# EAGLE design takujou_memo (EAGLE 9.6.2)
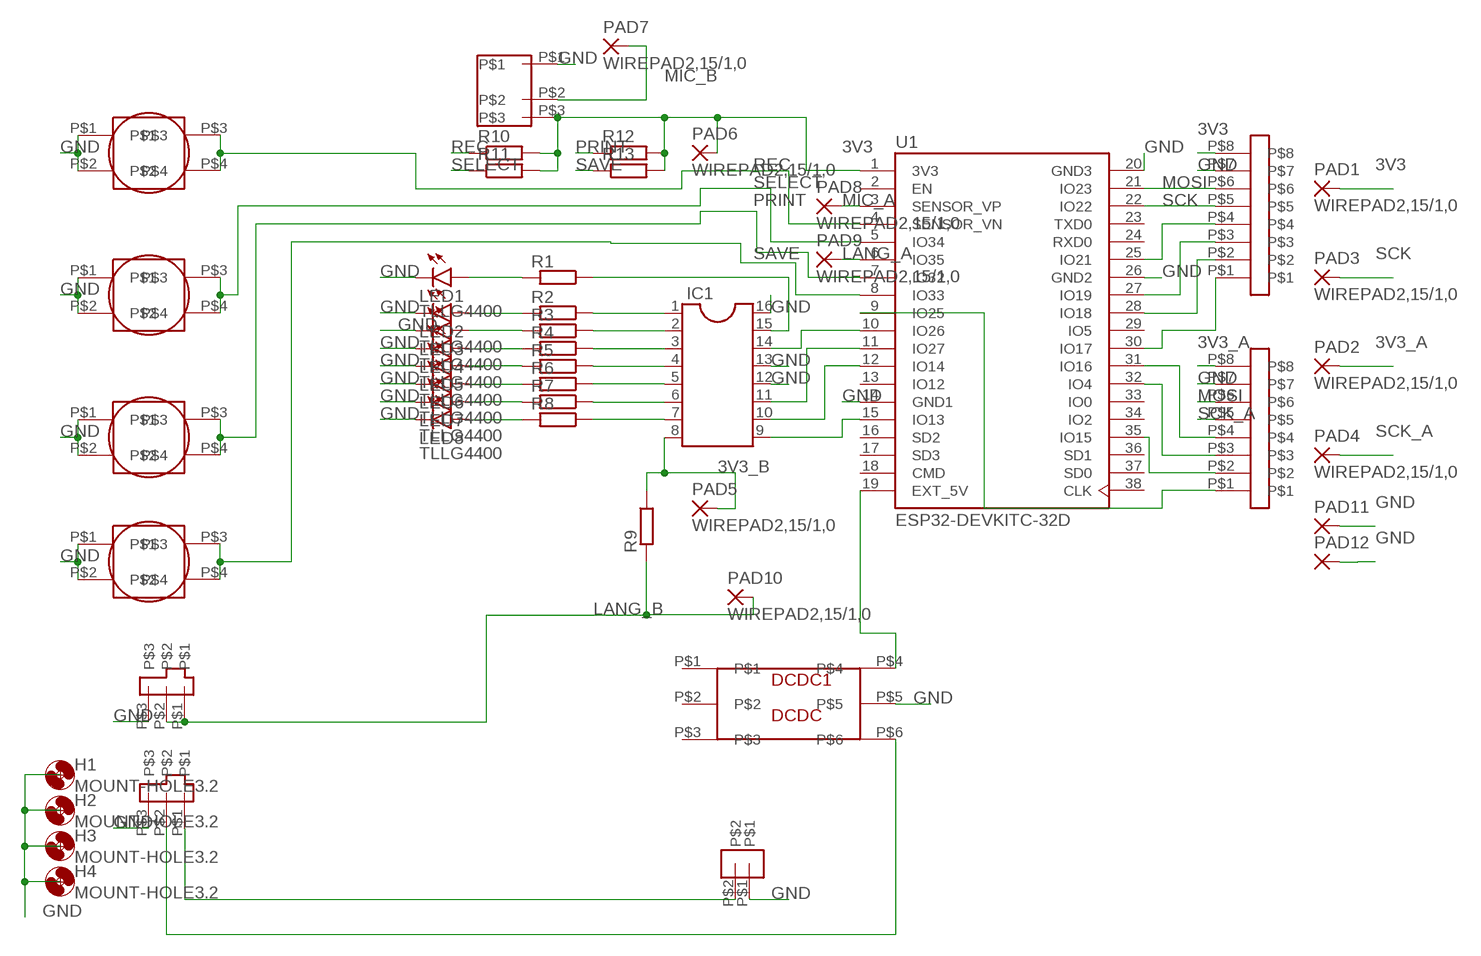
[diagram p0: schematic, sheet 1]

## Parts
BATTERY1  BATTERY  [BATTERY]
DCDC1  DCDC  [DCDC]
DISPLAY1  DISPLAY  [DISPLAY]
DISPLAY2  DISPLAY  [DISPLAY]
H1  MOUNT-HOLE3.2  [3,2]
H2  MOUNT-HOLE3.2  [3,2]
H3  MOUNT-HOLE3.2  [3,2]
H4  MOUNT-HOLE3.2  [3,2]
IC1  DIL16S  [SOCKET-16]
LED1  TLLG4400  [LED3MM]
LED2  TLLG4400  [LED3MM]
LED3  TLLG4400  [LED3MM]
LED4  TLLG4400  [LED3MM]
LED5  TLLG4400  [LED3MM]
LED6  TLLG4400  [LED3MM]
LED7  TLLG4400  [LED3MM]
LED8  TLLG4400  [LED3MM]
MIC1  MIC  [MIC]
PAD1  WIREPAD2,15/1,0  [2,15/1,0]
PAD2  WIREPAD2,15/1,0  [2,15/1,0]
PAD3  WIREPAD2,15/1,0  [2,15/1,0]
PAD4  WIREPAD2,15/1,0  [2,15/1,0]
PAD5  WIREPAD2,15/1,0  [2,15/1,0]
PAD6  WIREPAD2,15/1,0  [2,15/1,0]
PAD7  WIREPAD2,15/1,0  [2,15/1,0]
PAD8  WIREPAD2,15/1,0  [2,15/1,0]
PAD9  WIREPAD2,15/1,0  [2,15/1,0]
PAD10  WIREPAD2,15/1,0  [2,15/1,0]
PAD11  2,15/1,0  [2,15/1,0]
PAD12  2,15/1,0  [2,15/1,0]
R1  SMK  [SMK]
R2  SMK  [SMK]
R3  SMK  [SMK]
R4  SMK  [SMK]
R5  SMK  [SMK]
R6  SMK  [SMK]
R7  SMK  [SMK]
R8  SMK  [SMK]
R9  SMK  [SMK]
R10  R-EU_0207/10  [0207/10]
R11  R-EU_0207/10  [0207/10]
R12  R-EU_0207/10  [0207/10]
R13  R-EU_0207/10  [0207/10]
SWITCH1  SWITCH  [SWITCH]
SWITCH2  SWITCH  [SWITCH]
SWITCH3  SWITCH  [SWITCH]
SWITCH4  SWITCH  [SWITCH]
TOGGLE1  TOGGLE  [TOGGLE]
TOGGLE2  TOGGLE  [TOGGLE]
U1  ESP32-DEVKITC-32D  [MODULE_ESP32-DEVKITC-32D]

## Nets
3V3: DISPLAY1.P$8 MIC1.P$3 PAD1.1(P) PAD6.1(P) R10.2 R11.2 R12.2 R13.2 U1.1(3V3)
3V3_A: DISPLAY2.P$8 PAD2.1(P)
3V3_B: IC1.8 PAD5.1(P) R9.1
GND: BATTERY1.P$1 DCDC1.P$5 DISPLAY1.P$7 DISPLAY2.P$7 IC1.12 IC1.13 IC1.16 LED1.K(C) LED2.K(C) LED3.K(C) LED4.K(C) LED5.K(C) LED6.K(C) LED7.K(C) LED8.K(C) MIC1.P$1 PAD11.1(P) PAD12.1(P) SWITCH1.P$1 SWITCH1.P$2 SWITCH2.P$1 SWITCH2.P$2 SWITCH3.P$1 SWITCH3.P$2 SWITCH4.P$1 SWITCH4.P$2 TOGGLE1.P$3 TOGGLE2.P$3 U1.14(GND1) U1.20(GND3) U1.26(GND2)
LANG_A: PAD9.1(P) U1.6(IO35)
LANG_B: PAD10.1(P) R9.2 TOGGLE1.P$1 TOGGLE1.P$2
MIC_A: PAD8.1(P) U1.3(SENSOR_VP)
MIC_B: MIC1.P$2 PAD7.1(P)
MOSI: DISPLAY1.P$6 DISPLAY2.P$6 U1.21(IO23)
N$1: DISPLAY1.P$4 U1.25(IO21)
N$2: DISPLAY1.P$3 U1.27(IO19)
N$3: DISPLAY1.P$2 U1.28(IO18)
N$4: DISPLAY1.P$1 U1.30(IO17)
N$5: DISPLAY2.P$4 U1.31(IO16)
N$6: DISPLAY2.P$3 U1.32(IO4)
N$7: DISPLAY2.P$2 U1.35(IO15)
N$8: DISPLAY2.P$1 U1.9(IO25)
N$9: IC1.9 U1.15(IO13)
N$10: IC1.10 U1.12(IO14)
N$11: IC1.11 U1.11(IO27)
N$12: IC1.14 U1.10(IO26)
N$13: IC1.15 R1.1
N$14: IC1.1 R2.1
N$15: IC1.2 R3.1
N$16: IC1.3 R4.1
N$17: IC1.4 R5.1
N$18: IC1.5 R6.1
N$19: IC1.6 R7.1
N$20: IC1.7 R8.1
N$21: DCDC1.P$4 U1.19(EXT_5V)
N$22: LED1.A R1.2
N$23: LED2.A R2.2
N$24: LED3.A R3.2
N$25: LED4.A R4.2
N$26: LED5.A R5.2
N$27: LED6.A R6.2
N$28: LED7.A R7.2
N$29: LED8.A R8.2
N$30: DCDC1.P$6 TOGGLE2.P$2
N$31: BATTERY1.P$2 TOGGLE2.P$1
PRINT: R12.1 SWITCH3.P$3 SWITCH3.P$4 U1.7(IO32)
REC: R10.1 SWITCH1.P$3 SWITCH1.P$4 U1.4(SENSOR_VN)
SAVE: R13.1 SWITCH4.P$3 SWITCH4.P$4 U1.8(IO33)
SCK: DISPLAY1.P$5 PAD3.1(P) U1.22(IO22)
SCK_A: DISPLAY2.P$5 PAD4.1(P)
SELECT: R11.1 SWITCH2.P$3 SWITCH2.P$4 U1.5(IO34)
Unconnected: DCDC1.P$1 DCDC1.P$2 DCDC1.P$3 U1.2(EN) U1.13(IO12) U1.16(SD2) U1.17(SD3) U1.18(CMD) U1.23(TXD0) U1.24(RXD0) U1.29(IO5) U1.33(IO0) U1.34(IO2) U1.36(SD1) U1.37(SD0) U1.38(CLK)

## Library data of the parts
BATTERY1 = BATTERY:BATTERY
DCDC1 = DCDC:DCDC
DISPLAY1 DISPLAY2 = DISPLAY:DISPLAY
H1-H4 = holes:MOUNT-HOLE: MOUNTING HOLE with drill center marker
IC1 = ic-package:DIL16: Dual In Line / Socket
LED1-LED8 = led:TLLG4400: Low Current (2mA) LED 3 mm Tinted Diffused Package color GREEN Source: Data sheet <http://www.farnell.com/datasheets/391098.pdf>; MF: VISHAY SEMICONDUCTOR; OC_FARNELL: 1612435
MIC1 = MIC:MIC
PAD1-PAD10 = wirepad:WIREPAD: Wire PAD connect wire on PCB
PAD11 PAD12 = wirepad:2,15/1,0: THROUGH-HOLE PAD
R1-R9 = resistor-shunt:SMK: SMD SHUNT RESISTOR; OC_FARNELL: unknown; OC_NEWARK: unknown
R10-R13 = rcl:R-EU_: RESISTOR, European symbol; SPICEPREFIX: R
SWITCH1-SWITCH4 = SWITCH:SWITCH
TOGGLE1 TOGGLE2 = TOGGLE:TOGGLE
U1 = ESP32-DEVKITC-32D:ESP32-DEVKITC-32D: Eval Board For Esp-Wroom-32 Check availability <https://pricing.snapeda.com/parts/ESP32-DEVKITC-32D/Espressif%20Systems/view-part?ref=eda>; AVAILABILITY: In Stock; DESCRIPTION: WiFi Development Tools (802.11) ESP32 General Development Kit, ESP32-WROOM-32D on the board; MF: Espressif Systems; MP: ESP32-DEVKITC-32D; PACKAGE: None; PRICE: None; PURCHASE-URL: https://pricing.snapeda.com/search/part/ESP32-DEVKITC-32D/?ref=eda

## Board
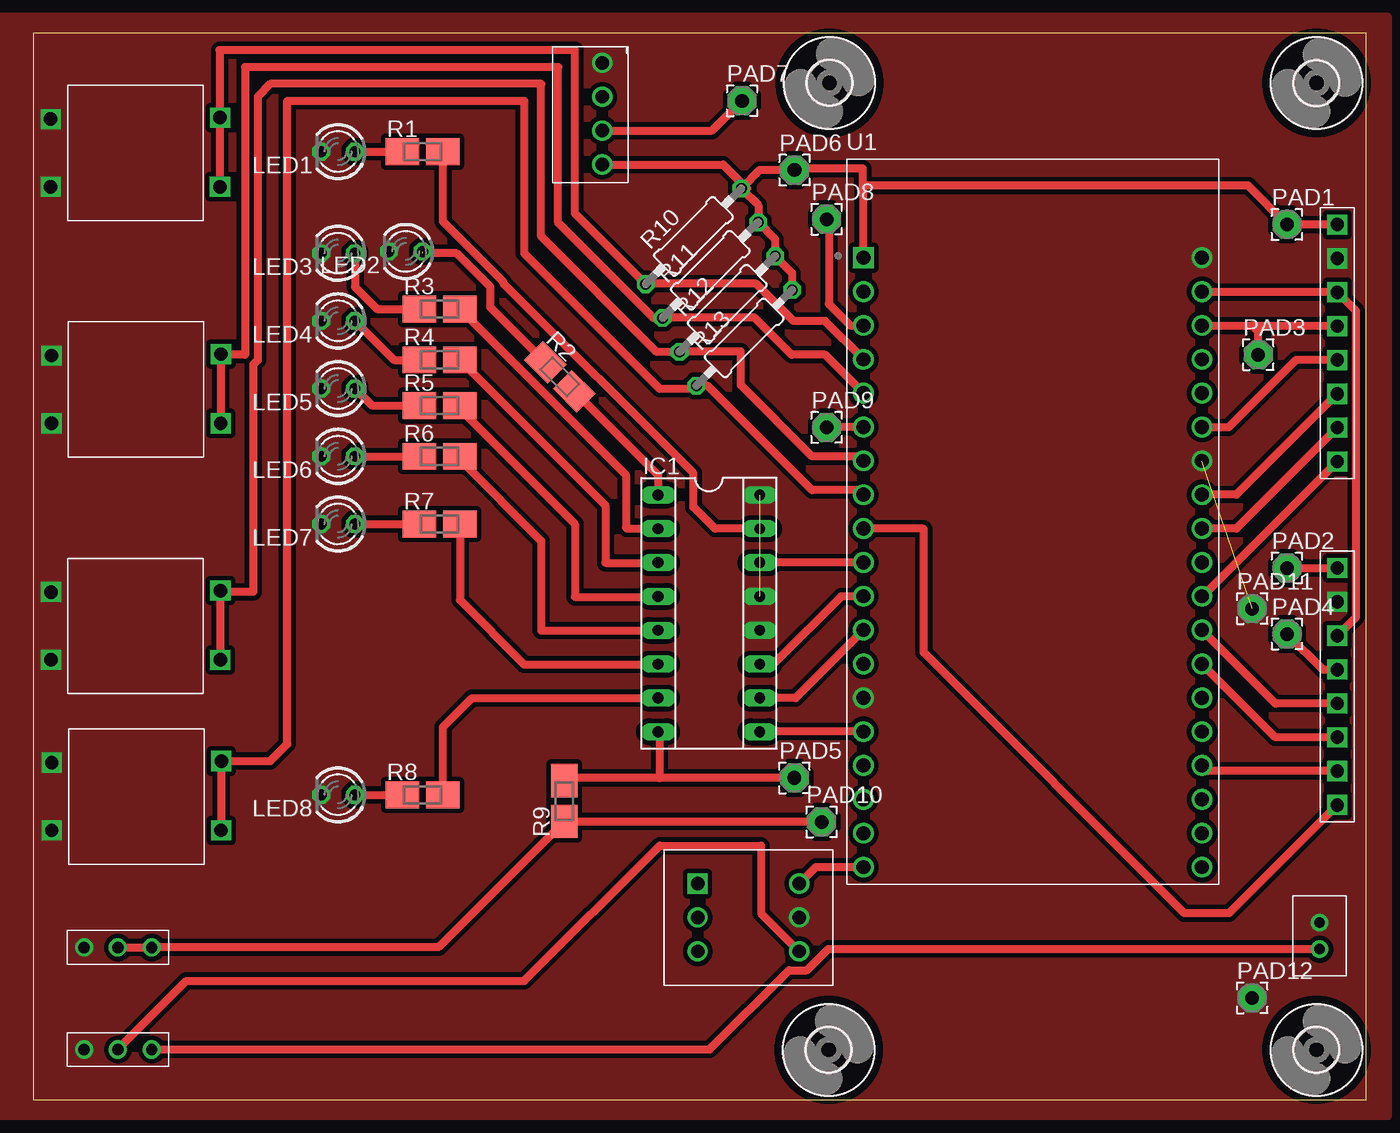
[diagram p1: board, top side]

Size 100 x 80 mm. Coordinates in mm from the lower left corner, seen from the top.
Outline: 0,0 100,0 100,80 0,80 0,0
Copper layers (1*16): Top 0.035mm / dielectric 1.5mm / Bottom 0.035mm
Design rules "default *": minimum track width 6mil, minimum drill 0.6mm, track to track 14mil, track to pad 14mil, pad to pad 14mil, via to via 14mil, smd to smd 6mil, copper to edge 0mil, drill to drill 6mil, minimum pad ring 10mil, minimum via ring 8mil, stop-mask expansion 4mil, vias tented up to drill 0mil, thermal gap 10mil

### Footprints (pad centres in the part's own frame; a part is rotated, then mirrored left to right if it is on the bottom)
BATTERY = drill 0.8: P$1 0,2; P$2 0,0
DCDC = drill 1 square: P$1 -5.08,2.54 | drill 1: P$2 -5.08,0; P$3 -5.08,-2.54; P$4 2.54,2.54; P$5 2.54,0; P$6 2.54,-2.54
DISPLAY = drill 1 square: P$1 0,7.62; P$2 0,5.08; P$3 0,2.54; P$4 0,0; P$5 0,-2.54; P$6 0,-5.08; P$7 0,-7.62; P$8 0,-10.16
3,2 = hole 3.2: 0,0
SOCKET-16 = drill 0.813 long: 1 -8.89,-3.81; 2 -6.35,-3.81; 3 -3.81,-3.81; 4 -1.27,-3.81; 5 1.27,-3.81; 6 3.81,-3.81; 7 6.35,-3.81; 8 8.89,-3.81; 9 8.89,3.81; 10 6.35,3.81; 11 3.81,3.81; 12 1.27,3.81; 13 -1.27,3.81; 14 -3.81,3.81; 15 -6.35,3.81; 16 -8.89,3.81
LED3MM = drill 0.813 octagon: A -1.27,0; K 1.27,0
MIC = drill 1: P$1 2.54,5.08; P$2 2.54,0; P$3 2.54,-2.54; P$4 2.54,2.54
2,15/1,0 = drill 1.016 pad 2.159 octagon: 1 0,0
SMK = smd 2.5 x 2: 1 1.524,0; 2 -1.524,0
0207/10 = drill 0.813 octagon: 1 -5.08,0; 2 5.08,0
SWITCH = drill 1 square: P$1 -6.35,2.54; P$2 -6.35,-2.54; P$3 6.35,-2.54; P$4 6.364,2.652
TOGGLE = drill 0.85: P$1 0,2.54; P$2 0,0; P$3 0,-2.54
MODULE_ESP32-DEVKITC-32D = drill 1.04 square: 1 -12.7,19.76 | drill 1.04: 2 -12.7,17.22; 3 -12.7,14.68; 4 -12.7,12.14; 5 -12.7,9.6; 6 -12.7,7.06; 7 -12.7,4.52; 8 -12.7,1.98; 9 -12.7,-0.56; 10 -12.7,-3.1; 11 -12.7,-5.64; 12 -12.7,-8.18; 13 -12.7,-10.72; 14 -12.7,-13.26; 15 -12.7,-15.8; 16 -12.7,-18.34; 17 -12.7,-20.88; 18 -12.7,-23.42; 19 -12.7,-25.96; 20 12.7,19.76; 21 12.7,17.22; 22 12.7,14.68; 23 12.7,12.14; 24 12.7,9.6; 25 12.7,7.06; 26 12.7,4.52; 27 12.7,1.98; 28 12.7,-0.56; 29 12.7,-3.1; 30 12.7,-5.64; 31 12.7,-8.18; 32 12.7,-10.72; 33 12.7,-13.26; 34 12.7,-15.8; 35 12.7,-18.34; 36 12.7,-20.88; 37 12.7,-23.42; 38 12.7,-25.96

### Placement (x,y rotation side)
BATTERY1  96.51,11.28 0 top
DCDC1  54.92,13.66 0 top
DISPLAY1  97.84,55.49 180 top
DISPLAY2  97.84,29.72 180 top
H1  96.27,76.27 0 top
H2  96.27,3.73 0 top
H3  59.73,76.29 0 top
H4  59.67,3.73 0 top
IC1  50.69,36.48 270 top
LED1  22.86,71.12 180 top
LED2  27.94,63.63 180 top
LED3  22.86,63.5 180 top
LED4  22.86,58.42 180 top
LED5  22.86,53.34 180 top
LED6  22.86,48.26 180 top
LED7  22.86,43.18 180 top
LED8  22.86,22.86 180 top
MIC1  40.15,72.7 0 top
PAD1  94.06,65.66 0 top
PAD2  94.06,39.88 0 top
PAD3  91.9,55.88 0 top
PAD4  94.06,34.92 0 top
PAD5  57.1,24.13 0 top
PAD6  57.11,69.73 0 top
PAD7  53.17,74.94 0 top
PAD8  59.52,66.05 0 top
PAD9  59.52,50.43 0 top
PAD10  59.13,20.83 0 top
PAD11  91.44,36.83 0 top
PAD12  91.44,7.62 0 top
R1  29.21,71.12 0 top
R2  39.5,54.23 315 top
R3  30.48,59.31 0 top
R4  30.48,55.5 0 top
R5  30.48,52.07 0 top
R6  30.48,48.26 0 top
R7  30.48,43.18 0 top
R8  29.21,22.86 0 top
R9  39.84,22.39 90 top
R10  49.53,64.77 45 top
R11  50.8,62.23 45 top
R12  52.07,59.69 45 top
R13  53.34,57.15 45 top
SWITCH1  7.65,71.03 0 top
SWITCH2  7.71,53.28 0 top
SWITCH3  7.68,35.53 0 top
SWITCH4  7.74,22.74 0 top
TOGGLE1  6.34,11.41 270 top
TOGGLE2  6.34,3.75 270 top
U1  74.98,43.4 0 top

### Tracks (layer width: path | path; a pad name or v marks a point on that pad's centre or on a via)
3V3
  Top 0.152: PAD1.1
  Top 0.61: DISPLAY1.P$8 PAD1.1 | PAD1.1 91.14,68.58 62.23,68.58 | U1.1 62.23,63.21 62.23,68.58 | 62.22,68.59 62.23,68.58 | 62.22,69.86 62.23,69.85 | 62.23,68.58 62.23,69.85 | R10.2 53.56,68.36 51.76,70.16 MIC1.P$3 | R10.2 54.39,67.09 R11.2 55.66,64.55 R12.2 56.93,62.01 R13.2 | R10.2 54.49,69.73 PAD6.1 57.22,69.85 62.23,69.85
3V3_A
  Top 0.61: PAD2.1 DISPLAY2.P$8
3V3_B
  Top 0.61: PAD5.1 46.99,24.13 | 46.99,24.13 40.06,24.13 R9.1 | IC1.8 46.99,27.48 46.99,24.13
GND  (2 unrouted)
  pour Top (no thermals): 101.6,81.28 101.6,-1.27 -2.54,-1.27 -2.54,81.28
LANG_A
  Top 0.61: PAD9.1 59.55,50.46 U1.6
LANG_B
  Top 0.61: PAD10.1 59.1,20.87 R9.2 30.4,11.43 8.89,11.43 | TOGGLE1.P$2 6.37,11.43 8.89,11.43 | 8.89,11.43 TOGGLE1.P$1
MIC_A
  Top 0.61: PAD8.1 59.69,65.88 59.69,59.69 61.3,58.08 U1.3
MIC_B
  Top 0.61: MIC1.P$2 50.93,72.7 PAD7.1
MOSI
  Top 0.152: 97.79,60.57 DISPLAY1.P$6 98.18,60.57 | 87.73,60.57 U1.21
  Top 0.61: 97.79,60.57 87.73,60.57 | DISPLAY2.P$6 99.25,36.21 99.25,59.16 DISPLAY1.P$6
N$1
  Top 0.152: 87.72,50.42 U1.25
  Top 0.61: DISPLAY1.P$4 94.74,55.49 89.66,50.42 87.72,50.42
N$2
  Top 0.61: DISPLAY1.P$3 90.26,45.38 U1.27
N$3
  Top 0.61: DISPLAY1.P$2 90.26,42.84 U1.28
N$4
  Top 0.152: 87.72,37.76 U1.30
  Top 0.61: DISPLAY1.P$1 87.72,37.76
N$5
  Top 0.61: DISPLAY2.P$4 93.18,29.72 U1.31
N$6
  Top 0.61: DISPLAY2.P$3 93.18,27.18 U1.32
N$7
  Top 0.61: DISPLAY2.P$2 88.1,24.64 U1.35
N$8
  Top 0.61: DISPLAY2.P$1 89.71,13.97 86.36,13.97 66.8,33.53 66.8,42.8 66.76,42.84 U1.9
N$9
  Top 0.61: U1.15 54.52,27.6 IC1.9
N$10
  Top 0.61: U1.12 57.19,30.13 IC1.10
N$11
  Top 0.61: U1.11 60.62,37.76 55.53,32.67 IC1.11
N$12
  Top 0.61: U1.10 54.52,40.3 IC1.14
N$13
  Top 0.61: IC1.15 51.15,42.83 49.53,44.45 49.53,46.99 35.26,61.27 35.26,61.36 30.73,65.88 R1.1
N$14
  Top 0.61: IC1.1 46.88,45.72 46.88,46.59 46.88,46.84 R2.1
N$15
  Top 0.61: R3.1 44.45,46.86 44.45,42.93 44.55,42.83 IC1.2
N$16
  Top 0.61: R4.1 42.93,44.58 42.93,40.26 46.85,40.26 IC1.3
N$17
  Top 0.61: R5.1 32,51.82 40.64,43.18 40.64,37.72 46.85,37.72 IC1.4
N$18
  Top 0.61: R6.1 32,48.01 38.1,41.91 38.1,35.18 46.85,35.18 IC1.5
N$19
  Top 0.61: R7.1 32,37.47 36.83,32.64 46.85,32.64 IC1.6
N$20
  Top 0.61: R8.1 30.73,27.94 32.92,30.13 IC1.7
N$21
  Top 0.61: DCDC1.P$4 58.7,17.44 U1.19
N$22
  Top 0.61: LED1.A R1.2
N$23  (1 unrouted)
  Top 0.61: R2.2 34.8,58.93 | 34.8,58.93 34.67,59.05 | 34.8,58.93 | 34.8,58.93 34.29,59.44 34.29,60.96 31.75,63.5 29.21,63.5
N$24
  Top 0.61: LED3.A 24.13,60.96 25.78,59.31 R3.2
N$25
  Top 0.61: LED4.A 27.05,55.5 R4.2
N$26
  Top 0.61: LED5.A 25.4,52.07 R5.2
N$27
  Top 0.61: LED6.A R6.2
N$28
  Top 0.61: LED7.A R7.2
N$29
  Top 0.61: LED8.A R8.2
N$30
  Top 0.61: TOGGLE2.P$2 11.48,8.89 36.83,8.89 46.99,19.05 54.61,19.05 54.61,13.97 DCDC1.P$6
N$31
  Top 0.61: TOGGLE2.P$1 50.74,3.75 56.7,9.71 58.05,9.71 59.64,11.3 96.49,11.3 BATTERY1.P$2
PRINT
  Top 0.61: SWITCH3.P$4 14.03,38.17 14.03,38.1 | 14.03,38.1 SWITCH3.P$3 | U1.7 61.94,48.26 58.42,48.26 53.09,53.59 53.09,56.13 48.51,56.13 R12.1 46.77,56.1 38.1,64.77 38.1,76.2 17.78,76.2 16.84,75.26 16.84,55.48 16.51,55.15 16.51,38.1 14.03,38.1
REC
  Top 0.61: SWITCH1.P$4 14,73.66 | 14,73.66 SWITCH1.P$3 | U1.4 59.4,58.42 57.02,58.42 54.23,61.21 45.97,61.21 R10.1 40.64,66.48 40.64,78.74 13.97,78.74 13.97,73.69 14,73.66
SAVE
  Top 0.61: 14.1,20.21 SWITCH4.P$4 14.11,25.4 17.78,25.4 19.05,26.67 19.05,74.93 36.83,74.93 36.83,63.5 46.99,53.34 49.53,53.34 R13.1 50.58,53.56 58.42,45.72 61.94,45.72 U1.8 | 14.1,20.21 SWITCH4.P$3 | 14.12,20.19 14.1,20.21
SCK
  Top 0.152: 97.79,58.08 DISPLAY1.P$5
  Top 0.61: U1.22 91.44,58.08 | 91.44,58.08 97.79,58.08 | PAD3.1 91.9,57.62 91.44,58.08
SCK_A
  Top 0.61: PAD4.1 96.73,32.26 DISPLAY2.P$5
SELECT
  Top 0.61: SWITCH2.P$4 14.06,55.92 | 14.06,55.92 SWITCH2.P$3 | U1.5 59.4,55.88 56.9,55.88 54.1,58.67 47.24,58.67 R11.1 46.52,58.64 39.37,65.79 39.37,77.47 15.88,77.47 15.88,55.88 14.1,55.88 14.06,55.92